# EasyEDA Pro project ProPrj_Dactyl_Manuform_飞线轴板-V2.0_2024-06-26.epro

# Board PCB_单轴体
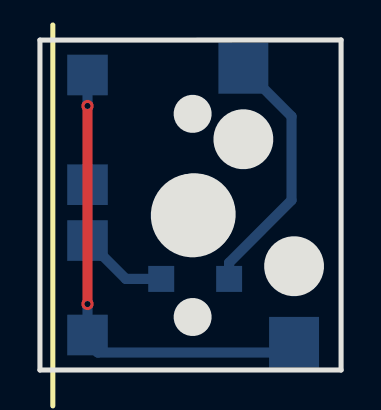
[diagram p0: board, top side]
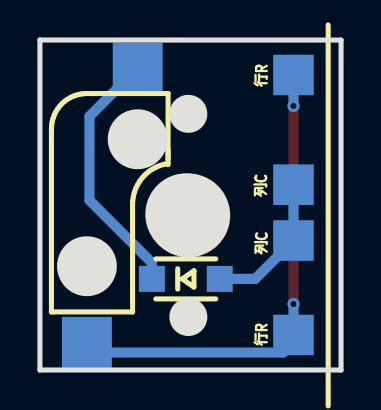
[diagram p1: board, bottom side, seen from below]

Outline 15.08 x 16.5 mm; copper layers: Top Layer, Bottom Layer. Coordinates in mm from the lower left corner of the outline.
Outline path: 0,0 0,16.5 15.08,16.5 15.08,0 0,0
Stack: Top Layer 0.035mm / Dielectric1 1.51mm FR4 er 4.5 / Bottom Layer 0.035mm

## Design rules (mm)
spacing Default (default): track to track 0.152, other pairs 0 to 0.152
track width Default (default): min 0.254, default 0.254, max 25.4
differential pair differentialPair (default): width min 0.127, default 0.254, max 2.54; gap min 0.152, default 0.152
via Default (default): diameter min 0.61, default 0.61, max 100.025; hole min 0.305, default 0.305, max 59.995

## Placement (name value [footprint] x y rotation side)
D2  1N4148W  [SOD-123FL_L2.6-W1.6-LS3.4-RD]  7.78 4.56 0 bottom
NOREF  -  [Pad_e5]  2.38 14.75 0 top
NOREF#2  -  [Pad_e6]  2.38 1.75 0 top
NOREF#3  -  [Pad_e7]  2.38 6.47 0 top
NOREF#4  -  [Pad_e8]  2.38 9.27 0 top
U46  凯华KAILH热插拔底座 COPY COPY  [凯华KAILH热插拔底座]  7.65 7.73 90 top

## Footprints (pads in the part's own frame, mm; a bottom-side part is the same pattern mirrored in y, then rotated)
Pad_e5
  rect 2.032x2.032 smd far side: 2(0,0)
Pad_e6
  rect 2.032x2.032 smd far side: 2(0,0)
Pad_e7
  rect 2.032x2.032 smd far side: 2(0,0)
Pad_e8
  rect 2.032x2.032 smd far side: 2(0,0)
SOD-123FL_L2.6-W1.6-LS3.4-RD
  rect 1.3x1.3 smd: 1(1.7,0) 2(-1.7,0)
凯华KAILH热插拔底座
  rect 2.55x2.5 smd far side: 1(-6.35,-5.08) 2(7.366,-2.54)

## Nets
COL: D2.2 NOREF#3.2 NOREF#4.2
ROW: NOREF.2 NOREF#2.2 U46.1
U1_2: D2.1 U46.2

## Via types
v1: diameter 0.61, hole 0.305, Top Layer to Bottom Layer, 2 vias

## Routing (per net, layer and track width the routed paths; a pad name or vN(x,y) marks a point on that pad's centre or on a via; arc(x,y) is an arc through that point)
COL: length 7.3
  Bottom Layer w0.508: NOREF#4.2 NOREF#3.2 4.3,4.56 D2.2
ROW: length 24.1
  Top Layer w0.508: v1(2.38,13.21) v1(2.38,3.3)
  Bottom Layer w0.508: v1(2.38,3.3) NOREF#2.2 2.38,1.39 2.9,0.87 12.22,0.87 U46.1 ; NOREF.2 v1(2.38,13.21)
U1_2: length 12.8
  Bottom Layer w0.508: U46.2 12.6,12.68 12.6,8.49 9.47,5.37 D2.1

## Text on the board
Bottom Silkscreen Layer: 列C | 行R
Top Silkscreen Layer: X轴方向，两边各向外扩展了10mil，以使边长大于1.5cm。减少额外的V割费用
